# EasyEDA Pro project 21届智能车+蚂蚁搬家+主驱一体PCB文件.epro, board PCB2
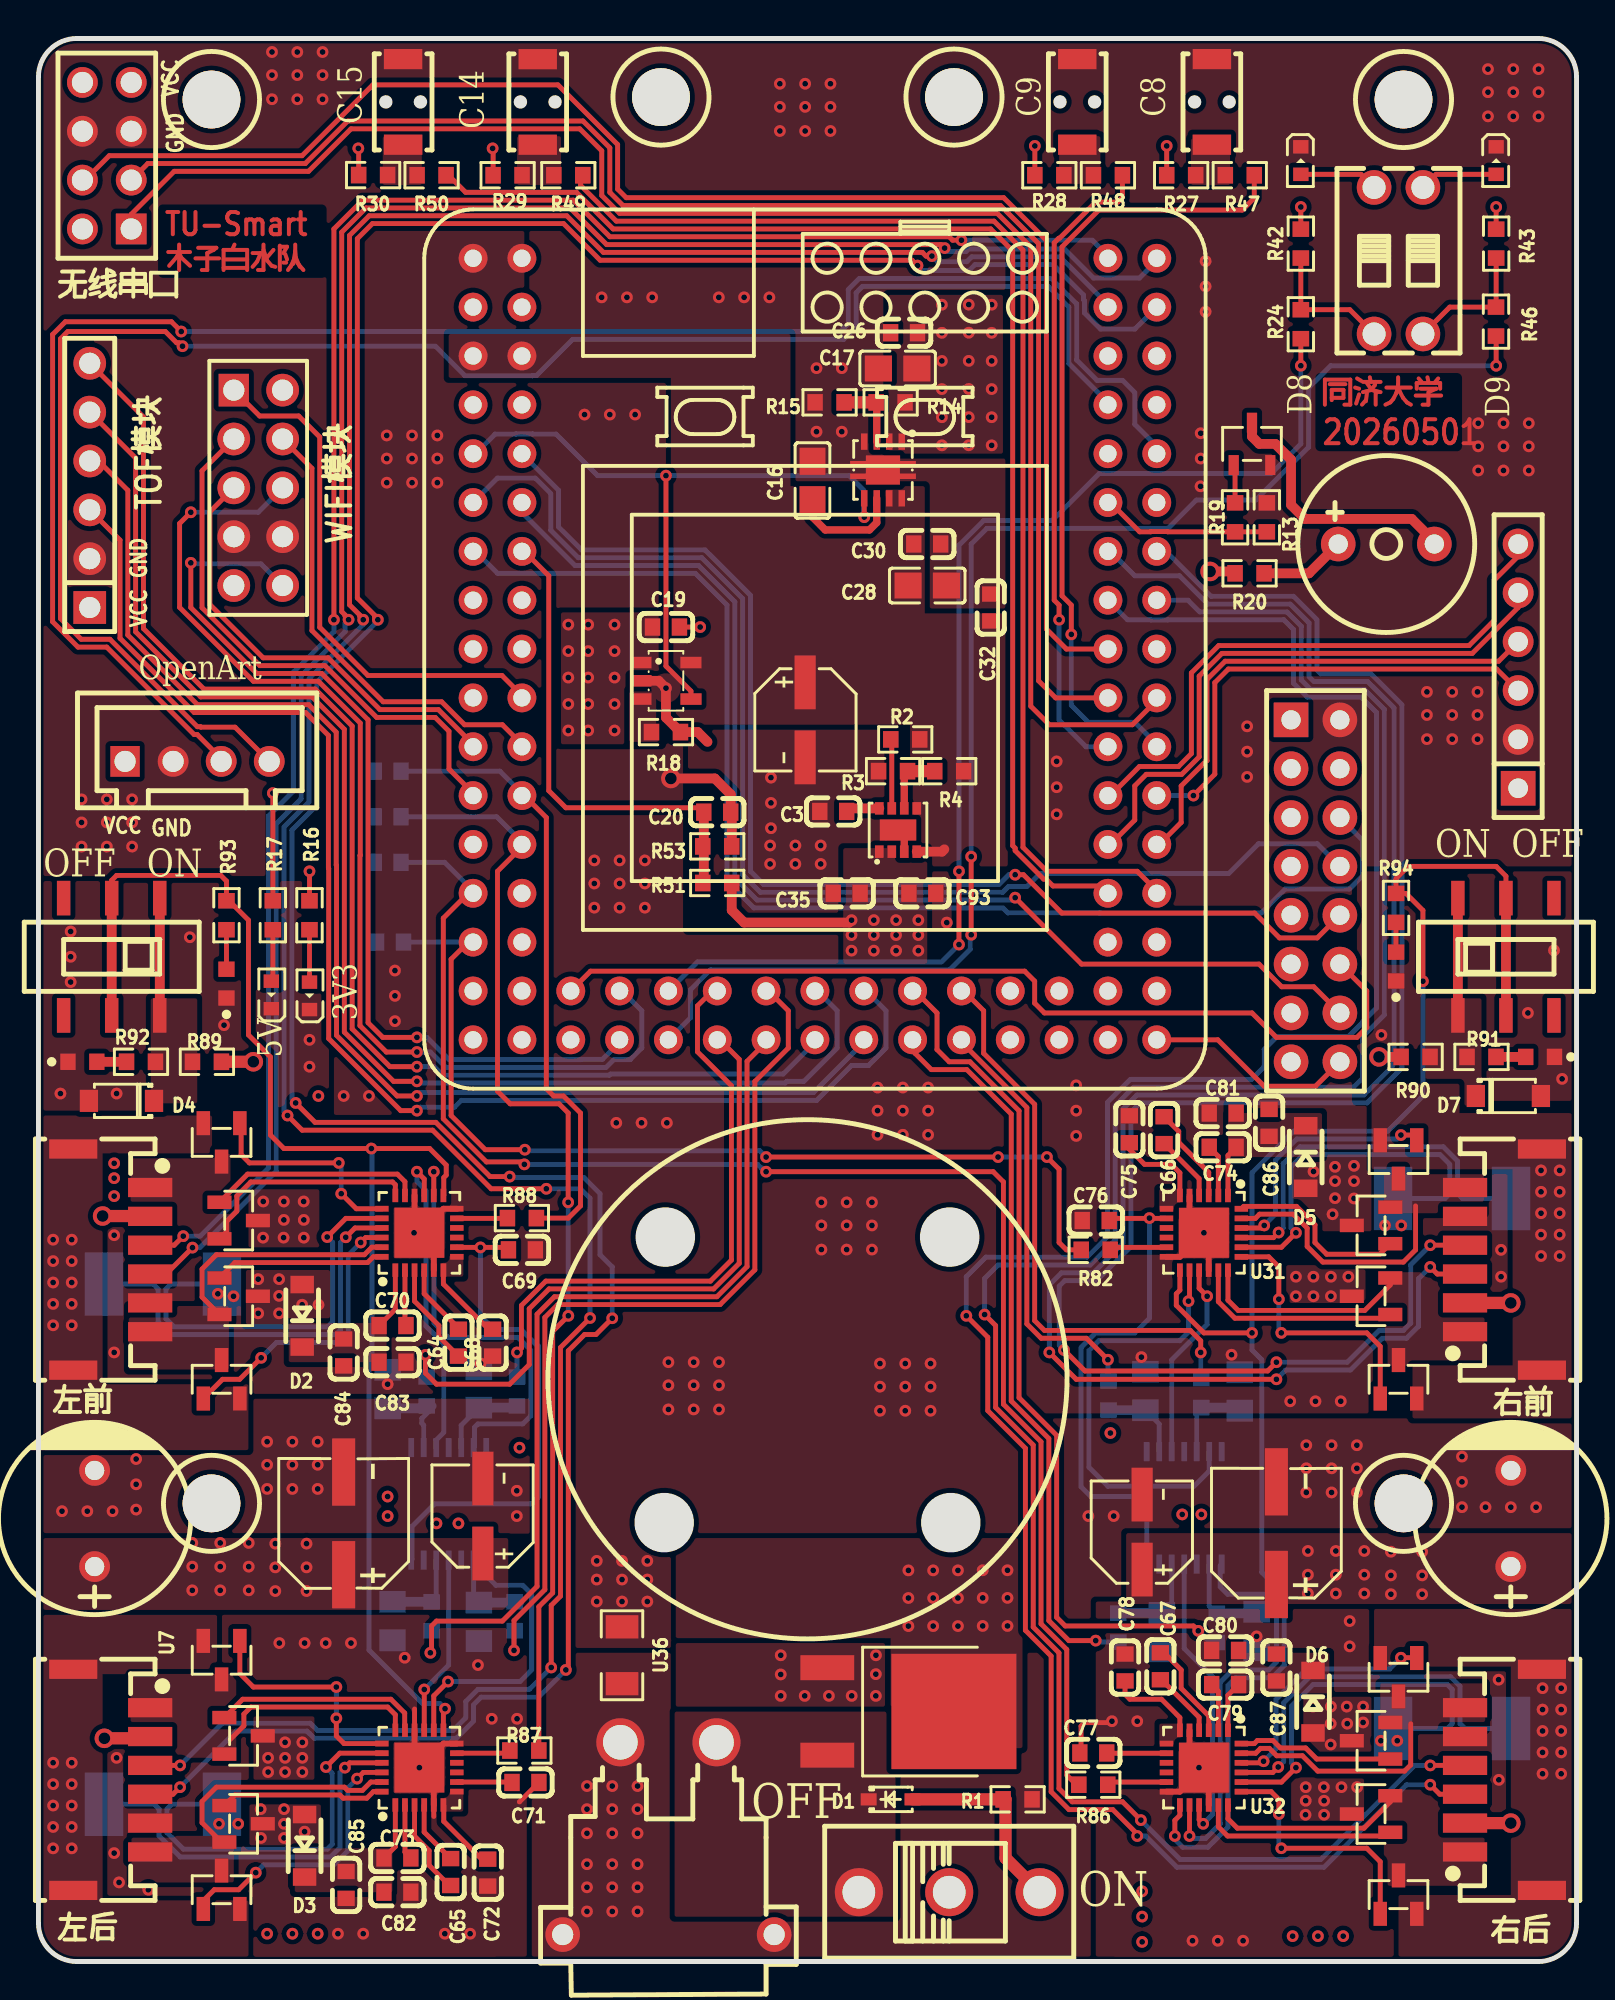
[diagram p37: board, top side]
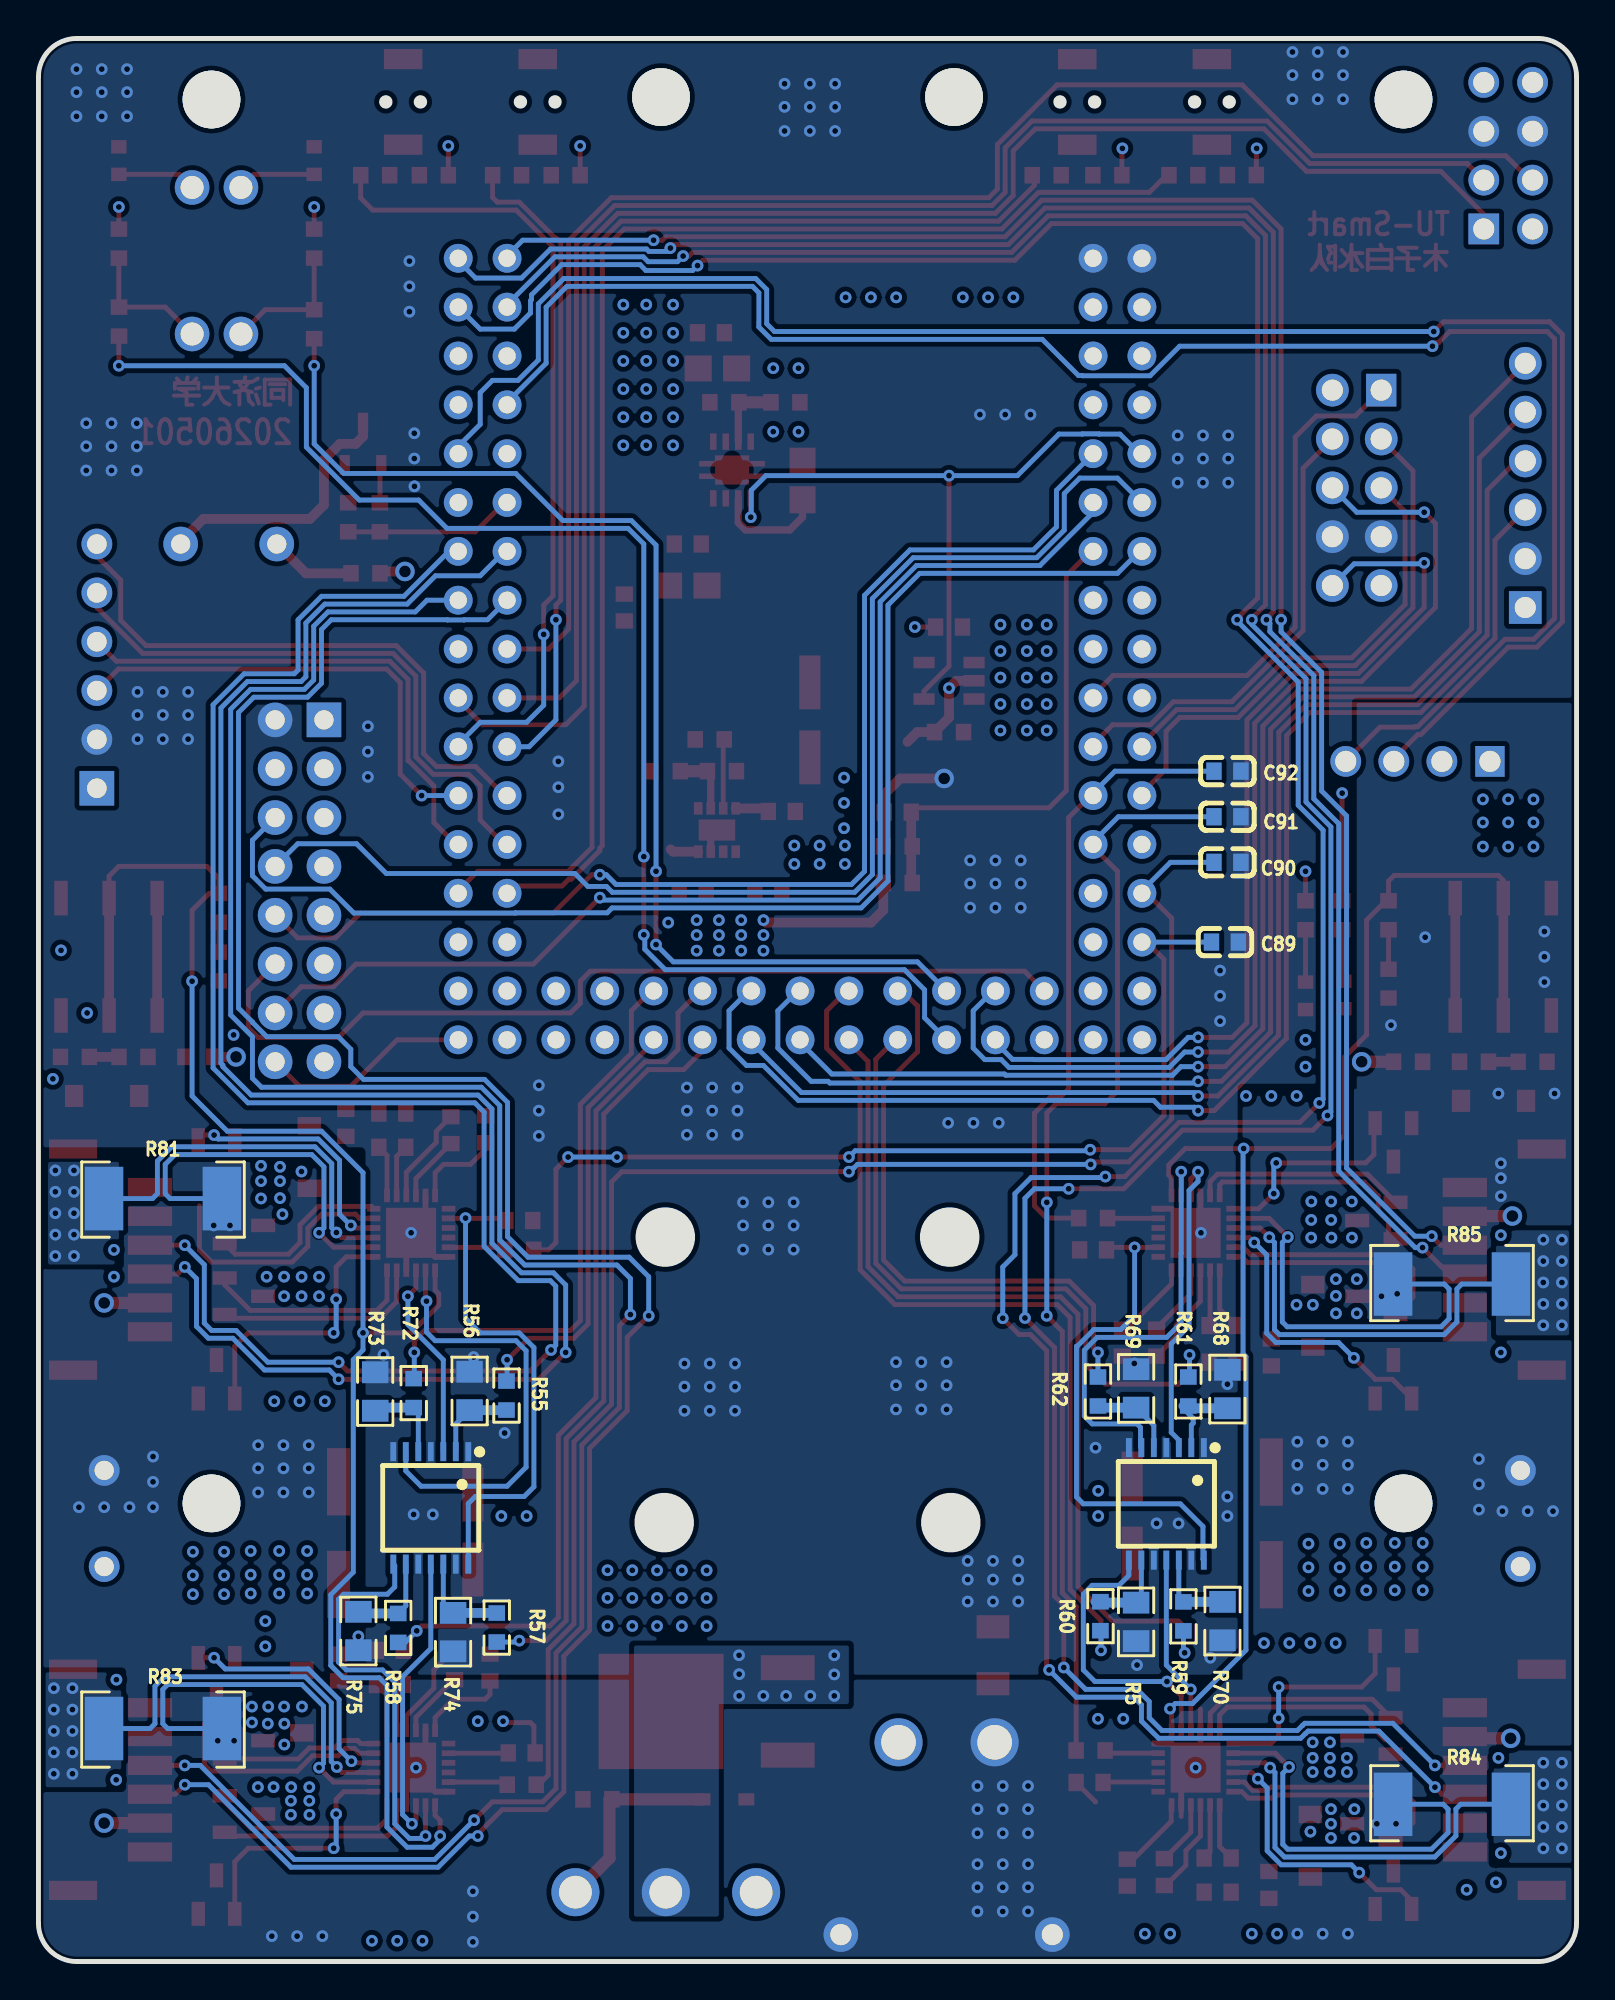
[diagram p38: board, bottom side, seen from below]

Outline 80 x 100 mm; copper layers: Top Layer, PGND, POWER, SIGNAL, GND, Bottom Layer. Coordinates in mm from the lower left corner of the outline.
Outline path: 0,98 0,2 arc(0.59,0.59) 2,0 78,0 arc(79.41,0.59) 80,2 80,98 arc(79.41,99.41) 78,100 2,100 arc(0.59,99.41) 0,98
Stack: Top Layer 0.035mm 外层铜厚1oz / Dielectric1 0.0994mm 3313 RC57% 4.2mil / PGND 0.0152mm 内层铜厚 / Dielectric2 0.55mm 0.55mm H/H No copper / POWER 0.0152mm 内层铜厚 / Dielectric3 0.1088mm 2116 RC54% 4.9mil / SIGNAL 0.0152mm 内层铜厚 / Dielectric4 0.55mm 0.55mm H/H No copper / GND 0.0152mm 内层铜厚 / Dielectric5 0.0994mm 3313 RC57% 4.2mil / Bottom Layer 0.035mm 外层铜厚1oz

## Design rules (mm)
spacing copperThickness1oz (default): track to track 0.152, other pairs 0.152 to 0.3
spacing copperThickness2oz: track to track 0.203, other pairs 0.152 to 0.3
spacing Plane_innerPlane: track to track 0.152, other pairs 0.152 to 0.3
spacing Copper_copperRegion: track to track 0.152, other pairs 0.152 to 0.3
spacing Copper_copperRegion1: track to track 0.152, other pairs 0.152 to 0.3
spacing Copper_copperRegion2: track to track 0.152, other pairs 0.152 to 0.3
track width copperThickness1oz (default): min 0.127, default 0.254, max 2.54
track width copperThickness2oz: min 0.203, default 0.254, max 2.54
differential pair differentialPair (default): width min 0.127, default 0.254, max 2.54; gap min 0.152, default 0.152
net PGND uses copperRegion1
pour e2148 uses Copper_copperRegion2, copperRegion2_Copper_copperRegion2
pour e2150 uses Copper_copperRegion2, copperRegion2_Copper_copperRegion2
pour e2152 uses Copper_copperRegion2, copperRegion2_Copper_copperRegion2
pour e2154 uses Copper_copperRegion2, copperRegion2_Copper_copperRegion2
pour e2156 uses Copper_copperRegion2, copperRegion2_Copper_copperRegion2
pour e2158 uses Copper_copperRegion2, copperRegion2_Copper_copperRegion2
pour e2160 uses Copper_copperRegion2, copperRegion2_Copper_copperRegion2
pour e2162 uses Copper_copperRegion2, copperRegion2_Copper_copperRegion2
pour e2164 uses Copper_copperRegion2, copperRegion2_Copper_copperRegion2
pour e2166 uses Copper_copperRegion2, copperRegion2_Copper_copperRegion2
pour e2168 uses Copper_copperRegion2, copperRegion2_Copper_copperRegion2
pour e2170 uses Copper_copperRegion2, copperRegion2_Copper_copperRegion2
pour e2172 uses Copper_copperRegion2, copperRegion2_Copper_copperRegion2
pour e2174 uses Copper_copperRegion2, copperRegion2_Copper_copperRegion2
pour e2176 uses Copper_copperRegion2, copperRegion2_Copper_copperRegion2
pour e2178 uses Copper_copperRegion2, copperRegion2_Copper_copperRegion2
pour e2180 uses Copper_copperRegion2, copperRegion2_Copper_copperRegion2
pour e2182 uses Copper_copperRegion2, copperRegion2_Copper_copperRegion2
pour e2184 uses Copper_copperRegion2, copperRegion2_Copper_copperRegion2
pour e2186 uses Copper_copperRegion2, copperRegion2_Copper_copperRegion2
pour e2188 uses Copper_copperRegion2, copperRegion2_Copper_copperRegion2
pour e2190 uses Copper_copperRegion2, copperRegion2_Copper_copperRegion2
pour e2192 uses Copper_copperRegion2, copperRegion2_Copper_copperRegion2
pour e2194 uses Copper_copperRegion2, copperRegion2_Copper_copperRegion2
pour e2196 uses Copper_copperRegion2, copperRegion2_Copper_copperRegion2
pour e2198 uses Copper_copperRegion2, copperRegion2_Copper_copperRegion2
pour e2200 uses Copper_copperRegion2, copperRegion2_Copper_copperRegion2
pour e2202 uses Copper_copperRegion2, copperRegion2_Copper_copperRegion2
pour e2204 uses Copper_copperRegion2, copperRegion2_Copper_copperRegion2
pour e2206 uses Copper_copperRegion2, copperRegion2_Copper_copperRegion2
pour e2208 uses Copper_copperRegion2, copperRegion2_Copper_copperRegion2
pour e2210 uses Copper_copperRegion2, copperRegion2_Copper_copperRegion2
pour e2212 uses Copper_copperRegion2, copperRegion2_Copper_copperRegion2
pour e2214 uses Copper_copperRegion2, copperRegion2_Copper_copperRegion2
pour e2216 uses Copper_copperRegion2, copperRegion2_Copper_copperRegion2
pour e2218 uses Copper_copperRegion2, copperRegion2_Copper_copperRegion2
pour e2220 uses Copper_copperRegion2, copperRegion2_Copper_copperRegion2
pour e2222 uses Copper_copperRegion2, copperRegion2_Copper_copperRegion2
pour e2224 uses Copper_copperRegion2, copperRegion2_Copper_copperRegion2
pour e2226 uses Copper_copperRegion2, copperRegion2_Copper_copperRegion2
pour e2228 uses Copper_copperRegion1, copperRegion2_Copper_copperRegion1
pour e2232 uses Copper_copperRegion1, copperRegion2_Copper_copperRegion1
pour e2236 uses Copper_copperRegion2, copperRegion2_Copper_copperRegion2
pour e2267 uses Copper_copperRegion2, copperRegion2_Copper_copperRegion2
pour e2269 uses Copper_copperRegion2, copperRegion2_Copper_copperRegion2
pour e2271 uses Copper_copperRegion2, copperRegion2_Copper_copperRegion2
pour e2273 uses Copper_copperRegion2, copperRegion2_Copper_copperRegion2
pour e2275 uses Copper_copperRegion2, copperRegion2_Copper_copperRegion2
pour e2277 uses Copper_copperRegion2, copperRegion2_Copper_copperRegion2
pour e2279 uses Copper_copperRegion2, copperRegion2_Copper_copperRegion2
pour e2281 uses Copper_copperRegion2, copperRegion2_Copper_copperRegion2
pour e2283 uses Copper_copperRegion2, copperRegion2_Copper_copperRegion2
pour e2285 uses Copper_copperRegion2, copperRegion2_Copper_copperRegion2
pour e2287 uses Copper_copperRegion2, copperRegion2_Copper_copperRegion2
pour e2289 uses Copper_copperRegion2, copperRegion2_Copper_copperRegion2
pour e2291 uses Copper_copperRegion2, copperRegion2_Copper_copperRegion2
pour e2293 uses Copper_copperRegion1, copperRegion2_Copper_copperRegion1
pour e2295 uses Copper_copperRegion2, copperRegion2_Copper_copperRegion2
pour e2297 uses Copper_copperRegion2, copperRegion2_Copper_copperRegion2
pour e2302 uses Copper_copperRegion2, copperRegion2_Copper_copperRegion2
pour e2306 uses Copper_copperRegion1, copperRegion2_Copper_copperRegion1
pour e2308 uses Copper_copperRegion2, copperRegion2_Copper_copperRegion2
pour e2311 uses Copper_copperRegion1, copperRegion2_Copper_copperRegion1
pour e2315 uses Copper_copperRegion1, copperRegion2_Copper_copperRegion1
pour e2317 uses Copper_copperRegion1, copperRegion2_Copper_copperRegion1
pour e2319 uses Copper_copperRegion1, copperRegion2_Copper_copperRegion1
pour e2324 uses Copper_copperRegion2, copperRegion2_Copper_copperRegion2

## Placement (name value [footprint] x y rotation side)
BUZZER1  3kHz  [BUZ-TH_BD9.0-P5.00-D0.6-FD]  70.1 73.71 0 top
C3  430pF  [C0603]  41.34 59.81 180 top
C16  10nF  [C0805]  40.26 77.01 270 top
C17  4.7uF  [C0805]  44.69 82.84 0 top
C19  100nF  [C0603]  32.64 69.39 180 top
C20  100nF  [C0603]  35.31 59.77 180 top
C21  47uF  [CAP-SMD_BD5.0-L5.3-W5.3-LS5.9-FD]  39.88 64.57 270 top
C25  1000uF  [CAP-TH_BD10.0-P5.00-D0.6-FD]  76.58 23.04 90 top
C26  100nF  [C0603]  45.02 84.7 180 top
C28  10uF  [C0805]  46.23 71.55 0 top
C30  100nF  [C0603]  46.23 73.71 0 top
C32  100nF  [C0603]  49.53 70.41 90 top
C35  100nF  [C0603]  42.04 55.55 0 top
C56  220uF  [CAP-SMD_BD6.3-L6.6-W6.6-LS7.3-FD-H7.7]  15.88 22.78 90 top
C57  220uF  [CAP-SMD_BD6.3-L6.6-W6.6-LS7.3-FD-H7.7]  64.39 22.28 90 top
C58  47uF  [CAP-SMD_BD5.0-L5.3-W5.3-LS5.9-FD]  23.11 23.16 90 top
C59  47uF  [CAP-SMD_BD5.0-L5.3-W5.3-LS5.9-FD]  57.4 22.33 90 top
C64  100nF  [C0603]  21.84 32.18 90 top
C65  100nF  [C0603]  21.44 4.65 90 top
C66  100nF  [C0603]  58.55 43.23 270 top
C67  100nF  [C0603]  58.35 15.35 270 top
C68  1uF  [C0603]  23.62 32.18 90 top
C69  1uF  [C0603]  25.15 37.01 180 top
C70  1uF  [C0603]  18.41 33.07 180 top
C71  1uF  [C0603]  25.33 9.31 180 top
C72  1uF  [C0603]  23.37 4.62 90 top
C73  1uF  [C0603]  18.67 5.38 180 top
C74  1uF  [C0603]  61.59 42.34 0 top
C75  1uF  [C0603]  56.74 43.28 270 top
C76  1uF  [C0603]  54.99 38.53 0 top
C77  1uF  [C0603]  54.86 10.85 0 top
C78  1uF  [C0603]  56.51 15.29 270 top
C79  1uF  [C0603]  61.72 14.4 0 top
C80  100nF  [C0603]  61.72 16.18 0 top
C81  100nF  [C0603]  61.59 44.12 0 top
C82  100nF  [C0603]  18.67 3.61 180 top
C83  100nF  [C0603]  18.41 31.17 180 top
C84  10uF  [C0603]  15.88 31.67 270 top
C85  10uF  [C0603]  16 3.99 270 top
C86  10uF  [C0603]  64.01 43.61 90 top
C87  10uF  [C0603]  64.39 15.29 90 top
C88  1000uF  [CAP-TH_BD10.0-P5.00-D0.6-FD]  2.92 23.04 90 top
C89  1nF  [C0603]  18.29 53.01 180 bottom
C90  1nF  [C0603]  18.16 57.16 180 bottom
C91  1nF  [C0603]  18.16 59.53 180 bottom
C92  1nF  [C0603]  18.16 61.9 180 bottom
C93  10uF  [C0603]  45.97 55.55 180 top
CN1  HC-PM254-8.5H-2x5PZ  [HDR-TH_10P-P2.54-V-F-R2-C5-S2.54-1]  11.43 76.63 270 top
CN2  ZX-XH2.54-4PZZ  [CONN-TH_4P-P2.50_4PIN]  8.25 62.41 0 top
CN3  XT30PW-M30.G.Y  [CONN-TH_XT30PW-M]  32.77 6.4 0 top
D1  BZT52C16S  [SOD-323_L1.7-W1.3-LS2.6-RD]  44.32 8.43 0 top
D2  1N5819W  [SOD-123_L2.7-W1.6-LS3.7-R-RD]  13.72 33.58 90 top
D3  1N5819W  [SOD-123_L2.7-W1.6-LS3.7-R-RD]  13.84 6.02 90 top
D4  BZT52C3V3  [SOD-123_L2.8-W1.8-LS3.7-RD]  4.32 44.75 180 top
D5  1N5819W  [SOD-123_L2.7-W1.6-LS3.7-R-RD]  65.91 41.83 270 top
D6  1N5819W  [SOD-123_L2.7-W1.6-LS3.7-R-RD]  66.29 13.51 270 top
D7  BZT52C3V3  [SOD-123_L2.8-W1.8-LS3.7-RD]  76.45 45.01 0 top
FH1  智能车逐飞摄像头固定孔  [智能车逐飞摄像头支架固定孔]  40 30.28 0 top
H1  PZ254V-11-06P  [HDR-TH_6P-P2.54-V-M]  2.67 76.76 90 top
J1  2.54-2*8P母  [HDR-TH_16P-P2.54-V-F-R2-C8-S2.54]  66.42 55.68 270 top
LED1  Blue  [LEDC1608(0603)]  9.78 50.85 90 top
LED2  =Color  [LEDC1608(0603)]  2.29 46.79 0 top
LED3  Blue  [LEDC1608(0603)]  70.61 51.74 90 top
LED4  =Color  [LEDC1608(0603)]  78.1 47.04 180 top
NOREF  -  [Pad_e629]  71 96.83 0 top
NOREF#2  -  [Pad_e628]  71 23.82 0 top
NOREF#3  -  [Pad_e627]  9 23.82 0 top
NOREF#4  -  [Pad_e626]  9 96.83 0 top
NOREF#5  -  [Pad_e630]  32.38 96.95 0 top
NOREF#6  -  [Pad_e631]  47.62 96.95 0 top
P4  2.54-1*6P母  [HDR-TH_6P-P2.54-V-F]  76.96 67.36 90 top
Q1  HY19P03D  [TO-252-2_L6.6-W6.1-P4.57-LS9.9-TL-CW]  44.32 13 0 top
Q10  S8050 J3Y(RANGE:200-350)  [SOT-23-3_L3.0-W1.7-P0.95-LS2.9-BR]  63.12 78.92 270 top
Q22  AO3400A  [SOT-23-3_L2.9-W1.3-P1.90-LS2.4-BR]  69.31 38.28 0 top
Q23  AO3400A  [SOT-23-3_L2.9-W1.3-P1.90-LS2.4-BR]  70.74 41.71 90 top
Q24  AO3400A  [SOT-23-3_L2.9-W1.3-P1.90-LS2.4-BR]  69.31 34.59 0 top
Q25  AO3400A  [SOT-23-3_L2.9-W1.3-P1.90-LS2.4-BR]  70.74 30.28 270 top
Q26  AO3400A  [SOT-23-3_L2.9-W1.3-P1.90-LS2.4-BR]  70.74 3.48 270 top
Q27  AO3400A  [SOT-23-3_L2.9-W1.3-P1.90-LS2.4-BR]  69.31 7.67 0 top
Q28  AO3400A  [SOT-23-3_L2.9-W1.3-P1.90-LS2.4-BR]  69.31 11.48 0 top
Q29  AO3400A  [SOT-23-3_L2.9-W1.3-P1.90-LS2.4-BR]  70.74 14.78 90 top
Q30  AO3400A  [SOT-23-3_L2.9-W1.3-P1.90-LS2.4-BR]  10.67 7.16 180 top
Q31  AO3400A  [SOT-23-3_L2.9-W1.3-P1.90-LS2.4-BR]  9.53 3.73 270 top
Q32  AO3400A  [SOT-23-3_L2.9-W1.3-P1.90-LS2.4-BR]  9.53 30.28 270 top
Q33  AO3400A  [SOT-23-3_L2.9-W1.3-P1.90-LS2.4-BR]  10.41 34.59 180 top
Q34  AO3400A  [SOT-23-3_L2.9-W1.3-P1.90-LS2.4-BR]  10.67 11.74 180 top
Q35  AO3400A  [SOT-23-3_L2.9-W1.3-P1.90-LS2.4-BR]  9.53 15.67 90 top
Q36  AO3400A  [SOT-23-3_L2.9-W1.3-P1.90-LS2.4-BR]  10.41 38.53 180 top
Q37  AO3400A  [SOT-23-3_L2.9-W1.3-P1.90-LS2.4-BR]  9.53 42.6 90 top
R1  10kΩ  [R0603]  50.93 8.43 180 top
R2  100kΩ  [R0603]  45.09 63.55 180 top
R3  100kΩ  [R0603]  44.45 61.9 180 top
R4  523kΩ  [R0603]  47.37 61.9 180 top
R5  10kΩ  [R0805]  22.91 17.66 90 bottom
R13  4.7kΩ  [R0603]  62.24 75.1 270 top
R14  30.9kΩ  [R0603]  44.32 81.08 0 top
R15  10kΩ  [R0603]  41.15 81.08 0 top
R16  2.7kΩ  [R0603]  14.1 54.41 90 top
R17  10kΩ  [R0603]  12.19 54.41 90 top
R18  4.7kΩ  [R0603]  32.64 63.93 180 top
R19  1kΩ  [R0603]  63.89 75.1 90 top
R20  10Ω  [R0603]  62.99 72.19 0 top
R24  100Ω  [R0603]  65.66 85.14 270 top
R27  4.7kΩ  [R0603]  59.44 92.89 180 top
R28  4.7kΩ  [R0603]  52.58 92.89 180 top
R29  4.7kΩ  [R0603]  24.4 92.89 180 top
R30  4.7kΩ  [R0603]  17.41 92.9 180 top
R42  4.7kΩ  [R0603]  65.66 89.33 90 top
R43  4.7kΩ  [R0603]  75.82 89.33 90 top
R46  100Ω  [R0603]  75.81 85.28 270 top
R47  100Ω  [R0603]  62.48 92.89 0 top
R48  100Ω  [R0603]  55.63 92.89 0 top
R49  100Ω  [R0603]  27.56 92.89 0 top
R50  100Ω  [R0603]  20.45 92.89 0 top
R51  10kΩ  [R0603]  35.31 56.08 180 top
R53  1kΩ  [R0603]  35.31 57.99 0 top
R55  100Ω  [R0603]  55.66 29.43 270 bottom
R56  100Ω  [R0603]  60.48 29.56 90 bottom
R57  100Ω  [R0603]  56.16 17.37 90 bottom
R58  100Ω  [R0603]  61.29 17.35 270 bottom
R59  100Ω  [R0603]  20.45 17.95 90 bottom
R60  100Ω  [R0603]  24.76 17.96 270 bottom
R61  100Ω  [R0603]  20.19 29.64 270 bottom
R62  100Ω  [R0603]  24.89 29.64 90 bottom
R68  10kΩ  [R0805]  18.16 29.77 90 bottom
R69  10kΩ  [R0805]  22.91 29.8 90 bottom
R70  10kΩ  [R0805]  18.41 17.7 90 bottom
R72  10kΩ  [R0805]  57.58 29.67 90 bottom
R73  10kΩ  [R0805]  62.48 29.64 90 bottom
R74  10kΩ  [R0805]  58.43 17.13 90 bottom
R75  10kΩ  [R0805]  63.36 17.19 90 bottom
R81  100mΩ  [RES-SMD_L6.4-W3.2-R2512]  73.52 39.67 0 bottom
R82  100Ω  [R0603]  54.99 37.01 0 top
R83  100mΩ  [RES-SMD_L6.4-W3.2-R2512]  73.52 12.12 0 bottom
R84  100mΩ  [RES-SMD_L6.4-W3.2-R2512]  6.48 8.18 180 bottom
R85  100mΩ  [RES-SMD_L6.4-W3.2-R2512]  6.48 35.23 180 bottom
R86  100Ω  [R0603]  54.86 9.19 0 top
R87  100Ω  [R0603]  25.27 10.97 180 top
R88  100Ω  [R0603]  25.15 38.66 180 top
R89  2.2kΩ  [R0603]  8.76 46.79 180 top
R90  2.2kΩ  [R0603]  71.63 47.04 0 top
R91  1kΩ  [R0603]  75.06 47.04 180 top
R92  1kΩ  [R0603]  5.33 46.79 0 top
R93  330Ω  [R0603]  9.78 54.41 270 top
R94  330Ω  [R0603]  70.61 54.79 270 top
SW2  SS-12D10L5R  [SW-TH_SS-12D10L9]  47.37 3.61 0 top
SW3  DSWB02LHGET  [SW-TH_DSWB02LHGET]  70.74 88.44 180 top
U2  DRV8701E  [VQFN-24_L4.0-W4.0-P0.50-BL-EP2.5]  19.81 10.08 0 top
U3  SN74HC125PWR  [TSSOP-14_L5.0-W4.4-P0.65-LS6.5-BL]  21.34 23.8 0 bottom
U5  SS-3235S-L1  [SW-SMD_SS-3235S-LX]  3.81 52.25 0 top
U7  ZX-ZH1.5-6PWT  [CONN-SMD_6P-P1.50_ZX-ZH1.5-6PWT]  3.81 9.45 270 top
U8  ZX-QC34-2TPDZ  [KEY-SMD_L3.9-W3.0-LS5.0-EH]  61.03 96.7 90 top
U9  ZX-QC34-2TPDZ  [KEY-SMD_L3.9-W3.0-LS5.0-EH]  54.03 96.7 90 top
U10  ZX-QC34-2TPDZ  [KEY-SMD_L3.9-W3.0-LS5.0-EH]  25.97 96.7 90 top
U11  ZX-QC34-2TPDZ  [KEY-SMD_L3.9-W3.0-LS5.0-EH]  18.97 96.7 90 top
U12  TPS82130SILR  [USIP-8_L3.0-W2.8-P0.65-TL-EP]  44.71 58.84 90 top
U13  ZX-ZH1.5-6PWT  [CONN-SMD_6P-P1.50_ZX-ZH1.5-6PWT]  3.81 36.5 270 top
U14  ZX-ZH1.5-6PWT  [CONN-SMD_6P-P1.50_ZX-ZH1.5-6PWT]  76.2 9.45 90 top
U15  ZX-ZH1.5-6PWT  [CONN-SMD_6P-P1.50_ZX-ZH1.5-6PWT]  76.2 36.5 90 top
U19  TPS7A8001DRBR  [VSON-8_L3.0-W3.0-P0.65-TL-EP]  43.93 77.56 270 top
U20  42-51/GHC-YW2X2K/3T  [LED-SMD_L1.6-W0.8-FD_GREEN-1]  14.1 50.22 270 top
U21  SY6280AAC  [SOT-23-5_L3.0-W1.7-P0.95-LS2.8-BR]  32.64 66.6 180 top
U22  42-51/GHC-YW2X2K/3T  [LED-SMD_L1.6-W0.8-FD_GREEN-1]  12.11 50.26 270 top
U23  42-51/GHC-YW2X2K/3T  [LED-SMD_L1.6-W0.8-FD_GREEN-1]  75.82 93.65 90 top
U24  42-51/GHC-YW2X2K/3T  [LED-SMD_L1.6-W0.8-FD_GREEN-1]  65.66 93.65 90 top
U25  HC-PM254-8.5H-2x4PZ-02A  [HDR-TH_8P-P2.54-V-F-R2-C4-S2.54]  3.56 93.9 90 top
U26  MIMXRT1021xAGxA_CoreBoard  [MIMXRT1021xAGxA_CoreBoard_V2.x]  40.39 68.25 0 top
U30  DRV8701E  [VQFN-24_L4.0-W4.0-P0.50-BL-EP2.5]  19.81 37.9 0 top
U31  DRV8701E  [VQFN-24_L4.0-W4.0-P0.50-BL-EP2.5]  60.62 37.89 180 top
U32  DRV8701E  [VQFN-24_L4.0-W4.0-P0.50-BL-EP2.5]  60.62 10.08 180 top
U33  SN74HC125PWR  [TSSOP-14_L5.0-W4.4-P0.65-LS6.5-BL]  59.59 23.59 0 bottom
U34  SS-3235S-L1  [SW-SMD_SS-3235S-LX]  76.33 52.25 180 top
U36  0Ω  [R1206]  30.35 15.93 270 top

## Footprints (pads in the part's own frame, mm; a bottom-side part is the same pattern mirrored in y, then rotated)
BUZ-TH_BD9.0-P5.00-D0.6-FD
  round 1.8 hole 1: 1(-2.5,0) 2(2.5,0)
C0603
  rect 0.8x0.9 smd: 1(-0.7,0) 2(0.7,0)
C0805
  rect 1.41x1.35 smd: 1(-1,0) 2(1,0)
CAP-SMD_BD5.0-L5.3-W5.3-LS5.9-FD
  rect 2.8x1.1 smd: 1(-1.95,0) 2(1.95,0)
CAP-SMD_BD6.3-L6.6-W6.6-LS7.3-FD-H7.7
  rect 3.5x1.2 smd: 1(-2.67,0) 2(2.67,0)
CAP-TH_BD10.0-P5.00-D0.6-FD
  round 1.6 hole 1: 1(-2.5,0) 2(2.5,0)
CONN-SMD_6P-P1.50_ZX-ZH1.5-6PWT
  rect 1x2.3 smd: 1(-3.75,2) 2(-2.25,2) 3(-0.75,2) 4(0.75,2) 5(2.25,2) 6(3.75,2)
  rect 1x2.5 smd: 7(5.75,-2) 8(-5.75,-2)
CONN-TH_4P-P2.50_4PIN
  rect 1.524x1.6 hole 1.1: 1(-3.75,0)
  round 1.6 hole 1.1: 2(-1.25,0) 3(1.25,0) 4(3.75,0)
CONN-TH_XT30PW-M
  round 2.5 hole 1.8: 1(-2.5,5) 2(2.5,5)
  round 1.8 hole 1.1: 3(5.5,-5) 4(-5.5,-5)
HDR-TH_6P-P2.54-V-F
  rect 1.8x1.8 hole 1.02: 1(-6.35,0)
  round 1.6 hole 1.02: 2(-3.81,0) 3(-1.27,0) 4(1.27,0) 5(3.81,0) 6(6.35,0)
HDR-TH_6P-P2.54-V-M
  rect 1.7x1.7 hole 1.1: 1(-6.35,0)
  round 1.7 hole 1.1: 2(-3.81,0) 3(-1.27,0) 4(1.27,0) 5(3.81,0) 6(6.35,0)
HDR-TH_8P-P2.54-V-F-R2-C4-S2.54
  rect 1.6x1.6 hole 1.1: 1(-3.81,-1.27)
  round 1.6 hole 1.1: 2(-3.81,1.27) 3(-1.27,-1.27) 4(-1.27,1.27) 5(1.27,-1.27) 6(1.27,1.27) 7(3.81,-1.27) 8(3.81,1.27)
HDR-TH_10P-P2.54-V-F-R2-C5-S2.54-1
  rect 1.7x1.575 hole 1.1: 1(-5.08,-1.27)
  round 1.7 hole 1.1: 2(-5.08,1.27) 3(-2.54,-1.27) 4(-2.54,1.27) 5(0,-1.27) 6(0,1.27) 7(2.54,-1.27) 8(2.54,1.27) 9(5.08,-1.27) 10(5.08,1.27)
HDR-TH_16P-P2.54-V-F-R2-C8-S2.54
  rect 1.8x1.8 hole 1: 1(-8.89,-1.27)
  round 1.8 hole 1: 2(-8.89,1.27) 3(-6.35,-1.27) 4(-6.35,1.27) 5(-3.81,-1.27) 6(-3.81,1.27) 7(-1.27,-1.27) 8(-1.27,1.27) 9(1.27,-1.27) 10(1.27,1.27) 11(3.81,-1.27) 12(3.81,1.27) 13(6.35,-1.27) 14(6.35,1.27) 15(8.89,-1.27) 16(8.89,1.27)
KEY-SMD_L3.9-W3.0-LS5.0-EH
  rect 1.05x2 smd: 1(-2.225,0) 2(2.225,0)
LED-SMD_L1.6-W0.8-FD_GREEN-1
  rect 0.7x0.8 smd: 1(-0.715,0) 2(0.715,0)
LEDC1608(0603)
  rect 0.8x0.85 smd: A(0.75,0) C(-0.75,0)
MIMXRT1021xAGxA_CoreBoard_V2.x
  round 1.5 hole 0.9: 1(-17.78,20.32) 2(-15.24,20.32) 3(-17.78,17.78) 4(-15.24,17.78) 5(-17.78,15.24) 6(-15.24,15.24) 7(-17.78,12.7) 8(-15.24,12.7) 9(-17.78,10.16) 10(-15.24,10.16) 11(-17.78,7.62) 12(-15.24,7.62) 13(-17.78,5.08) 14(-15.24,5.08) 15(-17.78,2.54) 16(-15.24,2.54) 17(-17.78,0) 18(-15.24,0) 19(-17.78,-2.54) 20(-15.24,-2.54) 21(-17.78,-5.08) 22(-15.24,-5.08) 23(-17.78,-7.62) 24(-15.24,-7.62) 25(-17.78,-10.16) 26(-15.24,-10.16) 27(-17.78,-12.7) 28(-15.24,-12.7) 29(-17.78,-15.24) 30(-15.24,-15.24) 31(-17.78,-20.32) 32(-17.78,-17.78) 33(-15.24,-20.32) 34(-15.24,-17.78) 35(-12.7,-20.32) 36(-12.7,-17.78) 37(-10.16,-20.32) 38(-10.16,-17.78) 39(-7.62,-20.32) 40(-7.62,-17.78) 41(-5.08,-20.32) 42(-5.08,-17.78) 43(-2.54,-20.32) 44(-2.54,-17.78) 45(0,-20.32) 46(0,-17.78) 47(2.54,-20.32) 48(2.54,-17.78) 49(5.08,-20.32) 50(5.08,-17.78) 51(7.62,-20.32) 52(7.62,-17.78) 53(10.16,-20.32) 54(10.16,-17.78) 55(12.7,-20.32) 56(12.7,-17.78) 57(15.24,-20.32) 58(15.24,-17.78) 59(17.78,-20.32) 60(17.78,-17.78) 61(15.24,-15.24) 62(17.78,-15.24) 63(15.24,-12.7) 64(17.78,-12.7) 65(15.24,-10.16) 66(17.78,-10.16) 67(15.24,-7.62) 68(17.78,-7.62) 69(15.24,-5.08) 70(17.78,-5.08) 71(15.24,-2.54) 72(17.78,-2.54) 73(15.24,0) 74(17.78,0) 75(15.24,2.54) 76(17.78,2.54) 77(15.24,5.08) 78(17.78,5.08) 79(15.24,7.62) 80(17.78,7.62) 81(15.24,10.16) 82(17.78,10.16) 83(15.24,12.7) 84(17.78,12.7) 85(15.24,15.24) 86(17.78,15.24) 87(15.24,17.78) 88(17.78,17.78) 89(15.24,20.32) 90(17.78,20.32)
Pad_e626
  round 3 hole 3: 1(0,0)
Pad_e627
  round 3 hole 3: 1(0,0)
Pad_e628
  round 3 hole 3: 1(0,0)
Pad_e629
  round 3 hole 3: 1(0,0)
Pad_e630
  round 3 hole 3: 1(0,0)
Pad_e631
  round 3 hole 3: 1(0,0)
R0603
  rect 0.806x0.864 smd: 1(-0.753,0) 2(0.753,0)
R0805
  rect 1.133x1.377 smd: 1(-1,0) 2(1,0)
R1206
  rect 1.208x1.701 smd: 1(-1.479,0) 2(1.479,0)
RES-SMD_L6.4-W3.2-R2512
  rect 2x3.3 smd: 1(-3.067,0) 2(3.067,0)
SOD-123_L2.7-W1.6-LS3.7-R-RD
  rect 0.909x1.219 smd: 1(1.625,0) 2(-1.625,0)
SOD-123_L2.8-W1.8-LS3.7-RD
  rect 0.95x1.15 smd: 1(-1.692,0) 2(1.692,0)
SOD-323_L1.7-W1.3-LS2.6-RD
  rect 0.83x0.63 smd: 1(-1.14,0) 2(1.14,0)
SOT-23-3_L2.9-W1.3-P1.90-LS2.4-BR
  rect 1.25x0.7 smd: 1(1,-0.95) 2(1,0.95) 3(-1,0)
SOT-23-3_L3.0-W1.7-P0.95-LS2.9-BR
  rect 1.038x0.532 smd: 1(1.101,-0.95) 2(1.101,0.95) 3(-1.101,0)
SOT-23-5_L3.0-W1.7-P0.95-LS2.8-BR
  rect 1.1x0.6 smd: 1(1.3,-0.95) 2(1.3,0) 3(1.3,0.95) 4(-1.3,0.95) 5(-1.3,-0.95)
SW-SMD_SS-3235S-LX
  rect 0.7x1.8 smd: 1(-2.5,3.05) 2(0,3.05) 3(2.5,3.05) 4(-2.5,-3.05) 5(0,-3.05) 6(2.5,-3.05)
SW-TH_DSWB02LHGET
  round 1.8 hole 1.2: 1(-1.27,3.81) 2(1.27,3.81) 3(-1.27,-3.81) 4(1.27,-3.81)
SW-TH_SS-12D10L9
  round 2.5 hole 1.7: 1(-4.7,0) 2(0,0) 3(4.7,0)
TO-252-2_L6.6-W6.1-P4.57-LS9.9-TL-CW
  rect 2.8x1.3 smd: 1(-3.292,2.273) 3(-3.292,-2.273)
  rect 6.5x6 smd: 2(3.292,0)
TSSOP-14_L5.0-W4.4-P0.65-LS6.5-BL
  rect 0.305x0.991 smd: 1(-1.95,-2.925) 2(-1.3,-2.925) 3(-0.65,-2.925) 4(0,-2.925) 5(0.65,-2.925) 6(1.3,-2.925) 7(1.95,-2.925) 8(1.95,2.925) 9(1.3,2.925) 10(0.65,2.925) 11(0,2.925) 12(-0.65,2.925) 13(-1.3,2.925) 14(-1.95,2.925)
USIP-8_L3.0-W2.8-P0.65-TL-EP
  rect 0.65x0.45 smd: 1(-1.125,0.975) 2(-1.125,0.325) 3(-1.125,-0.325) 4(-1.125,-0.975) 5(1.125,-0.975) 6(1.125,-0.325) 7(1.125,0.325) 8(1.125,0.975)
  rect 1.1x1.9 smd: 9(0,0)
VQFN-24_L4.0-W4.0-P0.50-BL-EP2.5
  rect 0.3x0.7 smd: 1(-1.25,-1.942) 2(-0.75,-1.942) 3(-0.25,-1.942) 4(0.25,-1.942) 5(0.75,-1.942) 6(1.25,-1.942) 13(1.25,1.942) 14(0.75,1.942) 15(0.25,1.942) 16(-0.25,1.942) 17(-0.75,1.942) 18(-1.25,1.942)
  rect 0.7x0.3 smd: 7(1.948,-1.25) 8(1.948,-0.75) 9(1.948,-0.25) 10(1.948,0.25) 11(1.948,0.75) 12(1.948,1.25) 19(-1.948,1.25) 20(-1.948,0.75) 21(-1.948,0.25) 22(-1.948,-0.25) 23(-1.948,-0.75) 24(-1.948,-1.25)
  rect 2.6x2.6 smd: 25(0.001,-0.001)
VSON-8_L3.0-W3.0-P0.65-TL-EP
  rect 0.85x0.34 smd: 1(-1.476,0.975) 2(-1.476,0.325) 3(-1.476,-0.325) 4(-1.476,-0.976) 5(1.476,-0.976) 6(1.476,-0.325) 7(1.476,0.325) 8(1.476,0.976)
  custom 1.52x3.42 smd: 9(0,-0.005)

## Nets
As in the schematic, except:
GND: C20.1 C68.1 C69.1 C71.1 C72.1 C75.1 C76.1 C77.1 C78.1 C80.1 C81.1 C82.1 C83.1 C84.2 C85.2 C86.2 C87.2 C89.2 C90.2 C91.2 C92.2 CN1.7 CN1.8 CN2.2 H1.2 J1.2 P4.2 Q10.2 R5.1 R19.2 R53.2 R68.2 R69.2 R70.1 R72.2 R73.2 R74.1 R75.1 U2.5 U2.12 U2.16 U2.25 U3.1 U3.4 U3.7 U3.10 U3.13 U7.5 U8.2 U9.2 U10.2 U11.2 U13.5 U14.5 U15.5 U23.2 U24.2 U25.5 U25.6 U26.1 U26.2 U30.5 U30.12 U30.16 U30.25 U31.5 U31.12 U31.16 U31.25 U32.5 U32.12 U32.16 U32.25 U33.1 U33.4 U33.7 U33.10 U33.13 U36.1
L_B_EN: U2.14 U3.8
L_B_EN_IN: R5.2 R60.1 U3.9
R_B_EN: U32.14 U33.8
R_B_EN_IN: R58.1 R75.2 U33.9
$4N16976: Q32.2 Q37.2 R85.2 U13.7 U13.8 U30.21
$4N17009: Q31.2 Q35.2 R84.2 U2.21 U7.7 U7.8
$4N17064: Q26.2 Q29.2 R83.2 U14.7 U14.8 U32.21
$4N17075: Q23.2 Q25.2 R81.2 U15.7 U15.8 U31.21

Pads without a net: CN1 2; J1 1 3 5 7 9 11 13 15; NOREF 1; NOREF#2 1; NOREF#3 1; NOREF#4 1; NOREF#5 1; NOREF#6 1; U2 9 10; U5 1 4; U25 2 8; U26 3 4 7 8 15 16 17 18 19 25 28 30 31 32 33 34 35 53 54 55 56 57 58 60 61 62 74 80 81 84 85 86; U30 9 10; U31 9 10; U32 9 10; U34 1 4

## Via types
v1: diameter 0.61, hole 0.305, Top Layer to Bottom Layer, 617 vias
v2: diameter 1.016, hole 0.61, Top Layer to Bottom Layer, 8 vias

## Routing (per net, layer and track width the routed paths; a pad name or vN(x,y) marks a point on that pad's centre or on a via; arc(x,y) is an arc through that point)
GND: length 39.5
  Top Layer w0.254: U2.16 19.56,13.13 ; C71.1 25.02,8.31 25.02,8.31 ; U2.5 20.56,7.54 ; C77.1 54.23,10.91 54.23,12.24 54.41,12.42 55.76,12.42 v1(55.84,12.5)
  Top Layer w0.305: U31.5 59.87,38.64 v1(60.62,37.89) ; U2.5 20.56,9.33 v1(19.81,10.08) ; U30.16 19.56,38.15 U30.25 ; v1(19.81,10.08) 21.06,11.33 U2.12 ; v1(19.81,10.08) 19.56,10.33 U2.16 ; 58.67,8.83 59.37,8.83 U32.25 ; U32.25 60.87,9.83 U32.16 ; U32.25 59.87,10.83 U32.5 ; v1(60.62,37.89) 60.87,37.64 U31.16 ; v1(60.62,37.89) 59.37,36.64 58.67,36.64 ; U30.5 20.56,37.15 U30.25 ; U30.12 21.06,39.15 U30.25
  Top Layer w0.508: R53.2 36.06,59.71 C20.1 36.01,60.69 35.18,61.52 v2(32.89,61.52)
  vias: v1(2.24,60.43) v1(2.24,59.23) v1(2.24,57.98) v1(3.56,60.43) v1(3.56,59.23) v1(3.56,57.98) v1(3.94,37.77) v1(3.94,31.67) v1(3.94,5.64) v1(4.06,10.59) v1(4.19,4.12) v1(4.87,60.43) v1(4.87,59.23) v1(4.87,57.98) v1(5.72,3.73) v1(12.15,99.3) v1(12.15,98.09) v1(12.15,96.84) v1(12.53,16.56) v1(13.46,99.3) v1(13.46,98.09) v1(13.46,96.84) v1(13.84,16.56) v1(14.56,45.01) v1(14.78,99.3) v1(14.78,98.09) v1(14.78,96.84) v1(14.94,16.56) v1(15.58,1.45) v1(15.88,45.01) v1(16.26,16.56) v1(16.89,1.45) v1(17.19,45.01) v1(18.12,79.36) v1(18.12,78.16) v1(18.12,76.9) v1(18.16,30.02) v1(18.16,24.18) v1(18.16,23.16) v1(18.54,51.53) v1(18.54,50.22) v1(18.54,48.9) v1(19.05,15.8) v1(19.43,79.36) v1(19.43,78.16) v1(19.43,76.9) v1(19.53,37.89) v1(20.75,79.36) v1(20.75,78.16) v1(20.75,76.9) v1(20.7,22.78) v1(21.14,1.45) v1(21.84,22.78) v1(22.45,1.45) v1(22.86,15.42) v1(23,31.1) v1(23.58,12.62) v1(24.89,12.62) v1(25.02,26.72) v1(28.4,80.44) v1(28.91,57.26) v1(28.91,56.06) v1(28.91,54.8) v1(29.04,20.83) v1(29.04,19.86) v1(29.04,18.72) v1(29.72,80.44) v1(30.05,43.61) v1(30.23,57.26) v1(30.23,56.06) v1(30.23,54.8) v1(30.35,20.83) v1(30.35,19.86) v1(30.35,18.72) v1(31.03,80.44) v1(31.37,43.61) v1(31.54,57.26) v1(31.54,56.06) v1(31.54,54.8) v1(31.67,20.83) v1(31.67,19.86) v1(31.67,18.72) v1(32.68,43.61) v1(32.77,31.17) v1(32.77,29.97) v1(32.77,28.71) v1(34.08,31.17) v1(34.08,29.97) v1(34.08,28.71) v1(35.4,31.17) v1(35.4,29.97) v1(35.4,28.71) v1(38.56,97.64) v1(38.56,96.44) v1(38.56,95.19) v1(39.88,97.64) v1(39.88,96.44) v1(39.88,95.19) v1(40.72,39.48) v1(40.72,38.28) v1(40.72,37.02) v1(41.19,97.64) v1(41.19,96.44) v1(41.19,95.19) v1(42.04,39.48) v1(42.04,38.28) v1(42.04,37.02) v1(43.35,39.48) v1(43.35,38.28) v1(43.35,37.02) v1(43.64,45.45) v1(43.64,44.25) v1(43.64,42.99) v1(43.77,31.1) v1(43.77,29.9) v1(43.77,28.64) v1(44.96,45.45) v1(44.96,44.25) v1(44.96,42.99) v1(45.09,31.1) v1(45.09,29.9) v1(45.09,28.64) v1(46.27,45.45) v1(46.27,44.25) v1(46.27,42.99) v1(46.4,31.1) v1(46.4,29.9) v1(46.4,28.64) v1(52.96,62.41) v1(52.96,61.06) v1(52.96,59.66) v1(53.97,45.56) v1(53.97,44.25) v1(53.97,42.93) v1(55.75,27.48) v1(57.15,12.5) v1(57.37,31.43) v1(59.49,23.25) v1(60.03,1.08) v1(60.44,76.71) v1(60.36,10.08) v1(60.45,79.47) v1(60.45,78.16) v1(60.49,23.25) v1(60.71,88.42) v1(60.71,87.11) v1(60.71,85.79) v1(61.34,1.08) v1(62.06,31.55) v1(62.66,1.08) v1(62.87,64.23) v1(62.87,62.92) v1(62.87,61.6) v1(63.36,16.91) v1(65.11,29.13) v1(66.42,29.13) v1(67.74,29.13) v1(68.2,17.7) v1(68.2,16.39) v1(72.22,66.02) v1(72.22,64.82) v1(72.22,63.57) v1(73.53,66.02) v1(73.53,64.82) v1(73.53,63.57) v1(74.85,66.02) v1(74.85,64.82) v1(74.85,63.57) v1(74.88,79.99) v1(74.88,78.79) v1(74.88,77.54) v1(75.39,98.41) v1(75.39,97.21) v1(75.39,95.95) v1(75.95,14.66) v1(75.96,9.45) v1(76.07,37.01) v1(76.07,35.61) v1(76.2,79.99) v1(76.2,78.79) v1(76.2,77.54) v1(76.71,98.41) v1(76.71,97.21) v1(76.71,95.95) v1(77.51,79.99) v1(77.51,78.79) v1(77.51,77.54) v1(78.02,98.41) v1(78.02,97.21) v1(78.02,95.95)
PGND: length 90.2
  Top Layer w0.254: U2.20 15.67,10.83 v1(14.95,10.12) ; C19.1 v1(34.42,69.39) ; U32.20 64.65,9.33 v1(65.41,10.08) ; v1(15.02,37.67) 15.99,38.65 U30.20 ; v1(65.41,37.9) 64.65,37.14 U31.20
  Top Layer w0.381: U12.9 45.03,58.51 U12.3
  Top Layer w0.508: 34.8,63.42 34.29,63.93 R18.1 32.64,64.69 v1(32.64,66.22) 32.26,66.6 U21.2
  Bottom Layer w0.254: R81.1 73.15,39.67 73.41,39.93 73.41,41.45 72.9,41.96 65.79,41.96 65.15,41.33 65.15,38.15 v1(65.41,37.9) ; R83.1 73.28,12.12 73.53,12.37 73.53,14.15 73.28,14.4 66.29,14.4 65.18,13.28 65.18,10.31 v1(65.41,10.08) ; R84.1 6.94,8.18 6.68,7.93 6.68,6.7 7.54,5.84 15.02,5.84 15.28,6.1 15.28,9.79 v1(14.95,10.12) ; R85.1 6.88,35.23 6.63,34.98 6.63,33.43 7.05,33.01 15.05,33.01 15.3,33.26 15.3,37.39 v1(15.02,37.67)
  vias: v1(1.14,45.14) v1(1.22,23.42) v1(1.67,53.56) v1(1.67,52.25) v1(1.67,50.93) v1(2.54,23.42) v1(3.94,41.51) v1(3.94,40.74) v1(3.94,39.8) v1(3.86,23.42) v1(4.06,45.14) v1(5.08,26.13) v1(5.08,24.82) v1(5.08,23.5) v1(7.87,53.26) v1(9.33,34.72) v1(9.39,7.16) v1(9.65,48.69) v1(10.15,34.59) v1(10.39,7.16) v1(11.89,27.03) v1(11.89,25.83) v1(11.89,24.58) v1(11.89,1.45) v1(13.21,27.03) v1(13.21,25.83) v1(13.21,24.58) v1(13.21,1.45) v1(14.1,47.93) v1(14.1,46.53) v1(14.52,27.03) v1(14.52,25.83) v1(14.52,24.58) v1(14.52,1.45) v1(24.88,24.48) v1(24.88,23.16) v1(28.53,9.13) v1(28.53,7.93) v1(28.53,6.67) v1(28.53,5.06) v1(28.53,3.86) v1(28.53,2.61) v1(29.29,86.54) v1(29.84,9.13) v1(29.84,7.93) v1(29.84,6.67) v1(29.84,5.06) v1(29.84,3.86) v1(29.84,2.61) v1(30.61,86.54) v1(31.16,9.13) v1(31.16,7.93) v1(31.16,6.67) v1(31.16,5.06) v1(31.16,3.86) v1(31.16,2.61) v1(31.92,86.54) v1(35.39,86.54) v1(36.7,86.54) v1(38.02,86.54) v1(38.1,61.56) v1(38.1,60.25) v1(38.1,58.93) v1(38.06,58.03) v1(38.06,57.07) v1(39.37,58.03) v1(39.37,57.07) v1(40.47,82.86) v1(40.47,79.55) v1(40.69,58.03) v1(40.69,57.07) v1(41.78,82.86) v1(41.78,79.55) v1(47.24,54.03) v1(54.61,23.16) v1(55.93,23.16) v1(57.4,3.65) v1(57.4,2.34) v1(57.4,1.02) v1(65.23,1.32) v1(65.94,26.85) v1(65.94,25.65) v1(65.94,24.39) v1(66.55,1.32) v1(67.26,26.85) v1(67.26,25.65) v1(67.26,24.39) v1(67.86,1.32) v1(68.57,26.85) v1(68.57,25.65) v1(68.57,24.39) v1(69.85,48.18) v1(69.82,11.48) v1(70.04,38.28) v1(70.68,11.48) v1(70.88,38.28) v1(74.04,26.26) v1(74.04,24.94) v1(74.04,23.63) v1(75.27,23.63) v1(76.58,23.63) v1(77.47,49.33) v1(77.9,23.63) v1(78.83,52.58) v1(79.25,45.9)
VCC3V3: length 20.7
  Top Layer w0.254: v1(16.64,94.28) 16.65,94.27 R30.2 ; R29.2 23.65,94.26 v1(23.62,94.28) ; R27.2 v1(58.68,94.41) ; R16.2 v1(14.1,56.69) ; R43.2 v1(75.82,91.24) ; R42.2 v1(65.66,91.24) ; R28.2 v1(51.82,94.41)
  Top Layer w0.508: 62.34,72.28 v2(60.94,72.28)
  Top Layer w0.635: U7.2 5.72,11.61 v2(3.43,11.61) ; U14.2 v2(76.58,7.2) ; v2(3.34,38.77) 5.63,38.77 5.72,38.86 ; 74.2,34.25 v2(76.58,34.25)
  vias: v1(46.99,86.16) v1(46.99,84.69) v1(46.99,83.23) v1(46.99,81.77) v1(46.99,80.31) v1(46.99,78.84) v1(48.39,86.16) v1(48.39,84.7) v1(48.39,83.24) v1(48.39,81.77) v1(48.39,80.31) v1(48.39,78.85) v1(49.58,86.16) v1(49.58,84.69) v1(49.58,83.23) v1(49.58,81.77) v1(49.58,80.31) v1(49.58,78.84)
VCC5V: length 1.5
  Top Layer w0.508: 47.12,57.84 47,57.71 U12.4
VCC5V_EXT: length 5.6
  Top Layer w0.254: R17.2 v1(12.19,60.76)
  vias: v1(27.56,69.52) v1(27.56,68.14) v1(27.56,66.77) v1(27.56,65.39) v1(27.56,64.01) v1(28.59,69.52) v1(28.59,68.14) v1(28.59,66.77) v1(28.59,65.39) v1(28.59,64.01) v1(29.96,69.52) v1(29.96,68.14) v1(29.96,66.77) v1(29.96,65.39) v1(29.96,64.01)
VCCBAT: length 10.8
  Top Layer w0.508: R90.1 v2(69.72,47.04) ; R51.1 36.06,54.67 36.7,54.03 42.16,54.03 v1(42.29,54.15)
  Top Layer w0.635: R89.1 v2(11.18,46.79)
  vias: v1(8,21.77) v1(8,20.54) v1(8,19.3) v1(9.45,21.77) v1(9.45,20.54) v1(9.45,19.3) v1(10.94,21.77) v1(10.94,20.54) v1(10.94,19.3) v1(11.43,35.48) v1(11.43,33.71) v1(11.56,7.93) v1(11.57,6.43) v1(11.69,39.52) v1(11.68,37.64) v1(11.94,10.59) v1(11.94,9.85) v1(12.32,21.73) v1(12.32,20.5) v1(12.32,19.27) v1(12.52,35.48) v1(12.52,34.61) v1(12.51,33.71) v1(12.76,39.52) v1(12.76,38.56) v1(12.75,37.64) v1(12.83,11.4) v1(12.83,10.59) v1(12.83,9.85) v1(12.77,7.93) v1(12.77,7.16) v1(12.77,6.43) v1(13.72,34.15) v1(13.73,11.4) v1(13.73,10.59) v1(13.73,9.85) v1(13.79,39.52) v1(13.8,38.56) v1(13.8,37.64) v1(13.84,6.76) v1(13.94,21.73) v1(13.94,20.5) v1(13.94,19.27) v1(14.57,34.15) v1(42.29,53.38) v1(42.29,52.57) v1(43.45,54.15) v1(43.45,53.38) v1(43.45,52.57) v1(44.61,54.15) v1(44.61,53.38) v1(44.61,52.57) v1(45.25,20.34) v1(45.25,18.9) v1(45.25,17.44) v1(45.77,54.15) v1(45.77,53.38) v1(45.77,52.57) v1(46.54,20.34) v1(46.54,18.9) v1(46.54,17.44) v1(47.82,20.34) v1(47.82,18.9) v1(47.82,17.44) v1(49.11,20.35) v1(49.11,18.91) v1(49.11,17.45) v1(50.4,20.35) v1(50.4,18.91) v1(50.4,17.45) v1(65.41,35.61) v1(65.41,34.59) v1(65.91,9.07) v1(65.91,8.36) v1(65.9,7.63) v1(66.03,21.35) v1(66.03,20.12) v1(66.03,19.14) v1(66.32,41.08) v1(66.31,35.61) v1(66.31,34.59) v1(66.29,13.26) v1(66.86,9.07) v1(66.87,8.36) v1(66.87,7.63) v1(67.22,35.61) v1(67.22,34.59) v1(67.22,13.26) v1(67.21,12.37) v1(67.21,11.28) v1(67.31,38.86) v1(67.44,41.33) v1(67.44,40.58) v1(67.44,39.7) v1(67.48,21.35) v1(67.48,20.12) v1(67.48,19.14) v1(67.77,9.07) v1(68.05,13.26) v1(68.13,35.61) v1(68.07,12.37) v1(68.42,41.38) v1(68.42,40.58) v1(68.42,39.68) v1(68.59,9.07) v1(68.9,13.26) v1(68.9,12.43) v1(68.96,21.35) v1(68.96,20.12) v1(68.96,19.14) v1(70.34,21.31) v1(70.34,20.08) v1(70.34,19.1) v1(71.97,21.31) v1(71.97,20.08) v1(71.97,19.1)
B3: length 57.5
  Top Layer w0.254: 19.81,47.3 18.09,47.3 16.72,48.67 16.72,57.51 16.74,57.53 16.74,64.4 14.56,66.57 11.18,66.57 7.34,70.42 7.34,74.78 v1(7.92,75.36)
  Bottom Layer w0.254: 19.81,47.3 20.39,47.3 21.19,46.49 29.52,46.49 29.93,46.9 30.78,46.9 31.38,47.5 31.38,49.44 30.35,50.47 ; CN1.6 11.43,75.36 v1(7.92,75.36)
  vias: v1(19.69,47.3)
B4: length 49.4
  Top Layer w0.254: 19.81,48.06 17.91,48.06 17.14,48.82 17.14,64.57 14.73,66.98 11.35,66.98 7.92,70.41 v1(7.92,72.73)
  Bottom Layer w0.254: 19.81,48.06 20.2,48.06 21.36,46.9 28.24,46.9 28.25,46.91 29.34,46.91 30.35,47.93 ; CN1.10 11.57,72.68 7.98,72.68 v1(7.92,72.73)
  vias: v1(19.69,48.06)
B5: length 48
  Top Layer w0.254: J1.12 69.09,50.47 69.09,48.56 68.58,48.06 64.39,48.06 63.12,49.33 52.32,49.33 51.82,49.83 51.82,50.98 51.29,51.5 28.72,51.5 U26.36
B12: length 51.4
  Top Layer w0.254: R82.1 53.47,37.01 53.09,37.39 53.09,41.2 v1(52.45,41.83) ; v1(25.3,42.22) 23.24,42.22 21.46,43.99 21.46,52.12 22.35,53.01 22.73,53.01 ; v1(37.85,41.83) v1(49.91,41.83)
  Bottom Layer w0.254: v1(37.85,41.83) 37.52,42.16 25.35,42.16 v1(25.3,42.22) ; v1(49.91,41.83) v1(52.45,41.83) ; C89.1 22.73,53.01
B14: length 80.7
  Top Layer w0.254: v1(37.85,41.07) 49.66,41.07 50.19,40.54 50.19,28.98 52.15,27.03 52.15,17.56 53.49,16.22 53.49,9.69 53.98,9.19 R86.1 ; v1(25.27,41.45) 25.26,41.45 25.13,41.58 23.3,41.58 21.06,43.82 21.06,54.25 22.35,55.55 22.73,55.55
  Bottom Layer w0.254: C90.1 21.12,57.16 22.73,55.55 ; v1(25.27,41.45) 37.4,41.45 37.6,41.25 37.67,41.25 v1(37.85,41.07)
B15: length 58.4
  Top Layer w0.254: R87.1 26.03,18.45 26.75,19.17 26.75,32.77 v1(27.56,33.58) ; v1(27.55,39.48) 27.55,44.13 27.08,44.6 24.54,44.6 23.88,45.26 23.88,56.69 25.27,58.09
  Bottom Layer w0.254: v1(27.55,39.48) 27.55,33.59 v1(27.56,33.58) ; C91.1 23.83,59.53 25.27,58.09
B17: length 32.3
  Top Layer w0.254: 25.27,60.63 26.42,59.49 26.42,45.39 26.8,45.01 27.31,45.01 28.19,44.12 28.19,39.29 27.56,38.66 R88.1
  Bottom Layer w0.254: C92.1 24,61.9 25.27,60.63
B18: length 28.9
  Top Layer w0.254: CN1.3 8.51,77.52 8.51,70.4 11.52,67.39 14.9,67.39 17.59,64.69 20.63,64.69 21.35,63.98 21.35,62.01 22.73,60.63
B19: length 24.1
  Top Layer w0.254: 25.27,63.17 24.13,64.31 22.16,64.31 20.97,65.51 17.93,65.51 14.22,69.21 14.22,77.65 CN1.4
B20: length 23.5
  Top Layer w0.254: 22.73,63.17 20.8,65.1 17.76,65.1 15.07,67.79 11.69,67.79 8.92,70.57 8.92,75.39 CN1.5
B21: length 27.5
  Top Layer w0.254: 25.27,65.71 24.11,66.88 17.14,66.88 14.63,69.38 14.63,79.27 13.54,80.37 11.5,80.37 CN1.1
B27: length 25.2
  Top Layer w0.254: C20.2 34.38,60 27.43,60 26.54,60.88 26.54,72.06 25.27,73.33
  Top Layer w0.508: R51.2 34.61,56.14 C20.2
B28: length 66.7
  Bottom Layer w0.254: 22.73,73.33 23.88,72.19 34.16,72.19 35.81,70.54 35.81,56.19 37.21,54.79 50.16,54.79 50.42,54.53 55.19,54.53 55.2,54.52 63.6,54.52 64.84,55.77 68.18,55.77 68.87,56.46 68.87,58.31 J1.6
B29: length 62.4
  Top Layer w0.254: v1(50.8,55.32) 54.25,51.87 63.48,51.87 64.66,50.69 66.33,50.69 J1.14
  Bottom Layer w0.254: U26.12 25.27,75.74 25.27,75.23 27.91,72.59 34.33,72.59 36.22,70.7 36.22,56.35 37.38,55.19 50.67,55.19 v1(50.8,55.32)
B30: length 65.6
  Bottom Layer w0.254: U26.11 23.88,77.14 25.84,77.14 26.64,76.34 26.64,74.43 28.08,73 34.5,73 36.63,70.87 36.63,56.52 37.55,55.6 50.15,55.6 50.46,55.91 51.42,55.91 52.1,56.58 61.91,56.58 63.46,58.13 66.51,58.13 J1.8
B31: length 63.4
  Top Layer w0.254: v1(50.8,56.52) 51.23,56.52 53.23,54.52 63.26,54.52 64.55,53.23 66.51,53.23 J1.10
  Bottom Layer w0.254: v1(50.8,56.52) 50.47,56.52 49.96,56.01 37.72,56.01 37.03,56.69 37.03,71.04 34.67,73.41 28.25,73.41 27.05,74.6 27.05,76.5 U26.10
C0: length 92.2
  Top Layer w0.254: v1(53.34,31.8) 54.43,30.71 63.93,30.71 v1(64.39,31.17) ; U15.4 v1(72.39,37.25)
  Bottom Layer w0.254: v1(64.39,31.17) 68.07,31.17 69.72,32.82 70.99,32.82 71.37,33.2 71.37,36.23 v1(72.39,37.25) ; v1(53.34,31.8) 53.09,32.05 53.09,35.12 53.38,35.41 55.04,35.41 56.82,37.19 56.82,44.17 57.3,44.65 69.1,44.65 70.92,46.47 70.92,65.35 69.3,66.97 66.69,66.97 66.5,67.16 66.5,69.77 65.28,70.99 60.99,70.99 58.65,73.33 58.29,73.33
C1: length 94.8
  Top Layer w0.254: v1(52.58,31.67) 53.97,30.28 v1(64.39,30.28) ; v1(72.39,36.12) 72.76,35.75 U15.3
  Bottom Layer w0.254: 55.75,73.33 57.02,72.06 59.35,72.06 60.82,70.59 65.11,70.59 66.09,69.6 66.09,66.81 66.34,66.56 69.13,66.56 70.51,65.18 70.51,46.72 70.41,46.61 70.41,46.53 68.93,45.06 57.13,45.06 56.41,44.34 56.41,37.35 54.87,35.81 53.21,35.81 52.58,35.18 v1(52.58,31.67) ; v1(72.39,36.12) 71.78,35.51 71.78,33.03 71.16,32.41 69.89,32.41 68.24,30.76 64.87,30.76 v1(64.39,30.28)
C2: length 116.2
  Top Layer w0.254: U14.4 v1(72.39,10.2) ; v1(57.34,7.35) 56.39,8.31 53.77,8.31 53.08,9 53.08,16.05 51.74,17.39 51.74,26.86 49.78,28.81 49.78,33.07 v1(49.21,33.64)
  Bottom Layer w0.254: v1(57.34,7.35) 59.38,5.31 66.69,5.31 71.58,10.2 v1(72.39,10.2) ; v1(49.21,33.64) 49.21,35.52 49.91,36.22 54.71,36.22 56.01,37.52 56.01,44.51 56.96,45.46 68.4,45.46 68.87,45.93 68.87,48.09 70,49.23 70,65.12 68.97,66.15 66.17,66.15 65.68,66.64 65.68,69.43 64.94,70.18 60.4,70.18 59.79,70.79 58.29,70.79
C3: length 118.9
  Top Layer w0.254: U14.3 72.89,8.7 v1(72.39,9.19) ; v1(48.26,33.58) 49.38,32.46 49.38,28.65 51.33,26.69 51.33,17.22 52.67,15.89 52.67,8.83 53.6,7.9 55.88,7.9 57.15,6.63 v1(57.15,6.53)
  Bottom Layer w0.254: v1(72.39,9.19) 71.16,9.19 66.86,4.9 59.22,4.9 57.59,6.53 v1(57.15,6.53) ; 55.75,70.79 55.75,70.66 56.64,69.77 57.85,69.77 57.87,69.76 58.72,69.76 58.73,69.77 64.77,69.77 65.28,69.27 65.28,66.47 66,65.75 68.8,65.75 69.6,64.95 69.6,49.58 68.87,48.86 68.87,48.84 68.12,48.09 64.41,48.09 63.75,47.44 63.75,46.53 63.09,45.87 56.8,45.87 55.6,44.68 55.6,37.69 54.54,36.63 49.28,36.63 48.26,35.61 v1(48.26,33.58)
C5: length 80.9
  Top Layer w0.254: 55.75,68.25 53.47,68.25 52.43,69.29 52.43,89.5 50.2,91.72 30.57,91.72 30.12,92.17 30.12,94.48 27.02,97.59 17.39,97.59 13.71,93.9 3.68,93.9 2.41,92.63 U25.4
C6: length 84.8
  Top Layer w0.254: U25.1 4.83,90.86 7.06,93.09 14.05,93.09 16.26,95.3 28.16,95.3 29.3,94.16 29.3,91.83 30.23,90.91 49.87,90.91 51.61,89.16 51.61,65.28 52.58,64.31 56.9,64.31 58.29,65.71
C7: length 79.3
  Top Layer w0.254: U25.3 5.69,93.5 13.88,93.5 16.09,95.71 28.32,95.71 29.72,94.31 29.72,92 30.4,91.31 50.03,91.31 52.02,89.33 52.02,66.6 52.91,65.71 55.75,65.71
C8: length 41.7
  Top Layer w0.254: R47.2 63.24,91.7 62.61,91.08 55.15,91.08 53.24,89.16 53.24,71.02 53.72,70.54 v1(53.72,69.01)
  Bottom Layer w0.254: 58.29,63.17 57.02,64.44 54.61,64.44 53.72,65.33 v1(53.72,69.01)
C9: length 33.8
  Top Layer w0.254: v1(53.09,69.77) 53.09,70.54 52.83,70.79 52.83,89.37 53.07,89.61 53.11,89.61 54.99,91.49 56.13,91.49 56.38,91.74 R48.2
  Bottom Layer w0.254: 55.75,63.17 54.48,63.17 53.09,64.57 v1(53.09,69.77)
C10: length 24.6
  Top Layer w0.254: P4.3 75.84,67.21 61.89,67.21 61.19,66.5 61.19,61.74 v1(60.07,60.63)
  Bottom Layer w0.254: 58.29,60.63 v1(60.07,60.63)
C11: length 30.7
  Top Layer w0.254: 55.75,60.63 57.26,62.14 59.3,62.14 59.97,62.81 59.97,67.01 61.39,68.43 74.41,68.43 75.72,69.74 75.72,71.84 76.96,73.08 P4.6
C12: length 26.6
  Top Layer w0.254: P4.4 75.95,67.62 61.72,67.62 60.78,66.67 60.78,62.44 60.75,62.44 59.44,61.13 59.44,59.23 58.29,58.09
C13: length 30.6
  Top Layer w0.254: 55.75,58.09 57.02,59.36 57.02,61.14 57.62,61.73 59.46,61.73 60.37,62.64 60.37,66.84 61.56,68.02 74.58,68.02 76.96,70.41 P4.5
C14: length 64.1
  Top Layer w0.254: R49.2 28.19,92.77 28.19,92.36 30.06,90.5 49.7,90.5 51.21,88.99 51.21,57.94 52.45,56.69 57.15,56.69 58.29,55.55
C15: length 68.3
  Top Layer w0.254: 55.75,55.55 55.75,55.68 55.5,55.93 52.77,55.93 52.41,56.29 52.28,56.29 50.8,57.77 50.8,57.9 50.67,58.02 50.67,88.95 49.53,90.09 29.89,90.09 27.98,92 22.22,92 21.33,92.89 R50.2
C21: length 11.1
  Top Layer w0.254: U26.59 61.34,47.93 63.75,45.52 66.42,45.52 J1.16
C28: length 29.7
  Top Layer w0.254: v1(60.45,31.67) 60.45,32.28 59.91,32.82 52.32,32.82 51.82,33.33 51.82,44.57 49.16,47.23 49.16,49.44 48.13,50.47
  Bottom Layer w0.254: R56.2 60.45,30.34 v1(60.45,31.67)
C29: length 22.2
  Top Layer w0.254: v1(55.63,31.29) 54.51,32.41 52.16,32.41 51.41,33.16 51.41,44.41 48.13,47.68 48.13,47.93
  Bottom Layer w0.254: R55.1 55.63,30.22 v1(55.63,31.29)
C30: length 45.1
  Top Layer w0.254: v1(60.32,17.2) 60.07,17.45 53.41,17.45 52.96,17.9 52.96,27.36 51,29.32 51,44.24 48.45,46.79 47.37,46.79 46.74,47.42 46.74,49.33 45.59,50.47
  Bottom Layer w0.254: v1(60.32,17.2) 60.93,16.59 R58.2
C31: length 38.2
  Top Layer w0.254: 45.59,47.93 45.59,47.23 46.44,46.38 48.29,46.38 50.6,44.07 50.6,29.15 52.55,27.19 52.55,17.73 53.59,16.69 v1(54.99,16.69)
  Bottom Layer w0.254: R57.1 55.07,16.61 v1(54.99,16.69)
CR: length 36.4
  Top Layer w0.254: U21.4 33.94,66.06 32.64,67.36 v1(32.64,77.27) ; 42.95,76.08 v1(42.95,75.11)
  Bottom Layer w0.254: 22.73,78.41 23.75,79.43 24.83,79.43 24.85,79.44 25.7,79.44 25.71,79.43 26.92,79.43 29.08,77.27 v1(32.64,77.27) 42.16,77.27 42.93,76.5 42.93,75.13 v1(42.95,75.11)
D0: length 71.3
  Top Layer w0.254: H1.3 4.24,73.91 4.24,68.81 8.1,64.95 13.89,64.95 15.08,63.76 15.08,56.85 15.1,56.84 15.1,47.99 18.84,44.25 v1(19.69,44.25)
  Bottom Layer w0.254: 43.05,50.47 44.08,49.44 44.08,47.5 43.17,46.6 42.29,46.6 40.48,44.78 22,44.78 21.64,44.42 19.86,44.42 v1(19.69,44.25)
D1: length 68.9
  Top Layer w0.254: H1.4 3.12,78.03 4.65,76.5 4.65,68.98 8.27,65.35 14.06,65.35 15.49,63.93 15.49,57.02 15.5,57 15.5,48.16 18.66,45.01 v1(19.69,45.01)
  Bottom Layer w0.254: 43.05,47.93 40.31,45.19 19.86,45.19 v1(19.69,45.01)
D2: length 72
  Top Layer w0.254: v1(19.69,45.77) 18.47,45.77 15.91,48.33 15.91,64.08 14.23,65.76 8.44,65.76 5.05,69.15 5.05,78.18 H1.5
  Bottom Layer w0.254: 40.51,50.47 41.54,49.44 41.54,47.5 39.81,45.77 38.93,45.77 38.84,45.68 19.77,45.68 v1(19.69,45.77)
D3: length 69.6
  Top Layer w0.254: 19.81,46.53 18.28,46.53 16.32,48.5 16.32,64.25 14.4,66.17 8.61,66.17 5.46,69.31 5.46,80.31 H1.6
  Bottom Layer w0.254: 19.81,46.53 20.57,46.53 21.02,46.09 29.69,46.09 29.75,46.15 38.74,46.15 40.51,47.93
  vias: v1(19.69,46.53)
D4: length 46.6
  Top Layer w0.254: v1(24.74,16.18) 24.74,17.73 26.34,19.34 26.34,33.49 27.01,34.16 35.46,34.16 37.26,35.97 37.26,45.76 39,47.5 39,49.44 37.97,50.47
  Bottom Layer w0.254: R60.2 24.74,17.17 v1(24.74,16.18)
D5: length 47.3
  Top Layer w0.254: 37.97,47.93 36.86,46.81 36.86,36.14 35.29,34.57 26.84,34.57 25.93,33.66 25.93,19.51 24.13,17.7 20.7,17.7 20.45,17.45 20.45,16.12 v1(20.38,16.05)
  Bottom Layer w0.254: R59.1 20.45,16.12 v1(20.38,16.05)
D6: length 31.1
  Top Layer w0.254: v1(24.89,31.67) 25.12,31.9 25.12,34.12 26.39,35.38 34.95,35.38 36.04,36.47 36.04,45.54 34.28,47.31 34.28,49.69 35.05,50.47 35.43,50.47
  Bottom Layer w0.254: v1(24.89,31.67) R62.2
D7: length 35
  Top Layer w0.254: v1(20.13,31.55) 20.13,30.59 20.7,30.02 24.51,30.02 25.53,31.04 25.53,33.95 26.56,34.98 35.12,34.98 36.45,36.31 36.45,46.91 35.43,47.93
  Bottom Layer w0.254: R61.1 20.13,30.46 v1(20.13,31.55)
D8: length 62.3
  Top Layer w0.254: v1(47.88,56.69) v1(47.88,52.88) ; R24.2 v1(65.66,82.98)
  Bottom Layer w0.254: v1(65.66,82.98) 65.66,78.92 64.12,77.38 55.17,77.38 52.72,74.93 49.16,74.93 47.88,73.65 v1(47.88,56.69) ; v1(47.88,52.88) 46.98,51.98 34.28,51.98 U26.40
D9: length 74.1
  Top Layer w0.254: R46.2 75.82,84.51 v1(75.82,82.98) ; v1(48.51,57.45) v1(48.51,53.39)
  Bottom Layer w0.254: U26.39 33.91,49.07 33.91,50.53 34.96,51.58 47.4,51.58 48.46,52.64 48.46,53.34 v1(48.51,53.39) ; v1(75.82,82.98) 67.21,82.98 66.07,81.84 66.07,78.75 63.31,76 60.22,76 58.75,74.52 49.33,74.52 48.51,73.71 v1(48.51,57.45)
D13: length 104.5
  Top Layer w0.254: v1(16.13,69.77) 15.95,69.95 15.95,70.02 15.77,70.19 15.77,89.93 17.03,91.19 27.65,91.19 29.55,89.28 46.95,89.28 v1(47.13,89.1) ; U13.4 6.64,35.75 v1(8.01,37.12)
  Bottom Layer w0.254: v1(47.13,89.1) 47.13,88.94 47.14,88.93 48.25,88.93 48.37,89.05 53.37,89.05 54.88,87.54 57.26,87.54 58.29,88.57 ; v1(16.13,69.77) 15.95,69.6 15.95,69.16 13.67,66.87 13.67,60.46 12.37,59.17 12.37,41.1 8.39,37.12 v1(8.01,37.12)
D14: length 100.3
  Top Layer w0.254: v1(48.01,89.51) 47.55,89.51 47.37,89.69 29.72,89.69 27.82,91.59 16.87,91.59 15.37,90.09 v1(15.37,69.77) ; v1(7.53,37.72) 7.06,37.25 U13.3
  Bottom Layer w0.254: v1(48.01,89.51) 54.81,89.51 55.75,88.57 ; v1(15.37,69.77) 15.37,69.15 13.26,67.04 13.26,60.87 11.96,59.57 11.96,41.27 8.41,37.72 v1(7.53,37.72)
D15: length 162
  Top Layer w0.254: v1(24.51,40.82) 23.49,40.82 20.67,43.64 14.39,43.64 v1(13.38,44.65) ; v1(45.72,88.19) 45.44,88.47 29.22,88.47 27.31,90.37 17.37,90.37 16.59,89.59 16.59,70.9 17.47,70.02 17.47,69.95 v1(17.65,69.77) ; U7.4 7,8.7 v1(7.37,9.07) ; v1(29.84,33.45) 29,32.61 28.41,32.61 27.56,31.76 27.56,15.29 v1(27.43,15.16)
  Bottom Layer w0.254: U26.88 57.02,84.89 55.25,84.89 54.41,85.72 54.41,86.37 54.36,86.42 54.36,86.67 52.78,88.24 48.71,88.24 48.41,87.94 45.97,87.94 v1(45.72,88.19) ; v1(7.37,9.07) 10.28,11.98 13.97,11.98 14.09,11.86 14.1,11.86 14.35,11.61 21.74,11.61 22.63,12.5 22.63,13.35 23.03,13.75 26.02,13.75 v1(27.43,15.16) ; v1(29.84,33.45) 29.84,36.12 29.21,36.75 29.21,39.93 28.37,40.77 24.56,40.77 v1(24.51,40.82) ; v1(17.65,69.77) 17.65,69.71 14.48,66.53 14.48,60.13 13.18,58.83 13.18,44.84 v1(13.38,44.65)
D16: length 156.5
  Top Layer w0.254: v1(28.69,33.46) 27.15,31.93 27.15,19 26.67,18.52 v1(26.67,15.29) ; v1(26.42,40.18) 23.55,40.18 20.5,43.23 13.72,43.23 v1(12.95,43.99) ; U7.3 v1(7.37,10.2) ; v1(46.47,88.69) 46.16,88.69 45.97,88.88 29.38,88.88 27.48,90.78 17.2,90.78 16.18,89.76 16.18,70.55 16.71,70.02 16.71,69.95 v1(16.89,69.77)
  Bottom Layer w0.254: v1(12.95,43.99) 12.78,44.17 12.78,59 14.07,60.3 14.07,66.7 16.89,69.52 v1(16.89,69.77) ; v1(26.42,40.18) 28.19,40.18 28.69,39.69 v1(28.69,33.46) ; v1(26.67,15.29) 25.53,14.15 22.86,14.15 22.22,13.52 22.22,12.67 21.57,12.01 14.52,12.01 14.27,12.27 14.26,12.27 14.14,12.39 9.56,12.39 v1(7.37,10.2) ; v1(46.47,88.69) 46.76,88.39 48.29,88.39 48.54,88.65 53.14,88.65 55.75,86.03
D20: length 91.4
  Top Layer w0.254: CN2.4 10.23,64.19 8.45,64.19 8.42,64.21 8.26,64.21 3.72,68.76 2.22,68.76 1.14,69.84 1.14,84.38 1.52,84.76 6.6,84.76 7.18,84.18 7.31,84.18 v1(7.49,84)
  Bottom Layer w0.254: 55.75,80.95 53.59,83.11 53.59,86.03 52.51,87.11 42.86,87.11 42.53,86.78 42.53,85 41.88,84.35 27.79,84.35 25.91,82.47 25.71,82.47 25.7,82.46 22.18,82.46 20.64,84 v1(7.49,84)
D21: length 93.6
  Top Layer w0.254: CN2.3 9.5,62.56 8.25,63.81 8.1,63.81 3.55,68.35 2.06,68.35 0.74,69.67 0.74,84.61 1.4,85.27 6.92,85.27 v1(7.43,84.76)
  Bottom Layer w0.254: v1(7.43,84.76) 41.72,84.76 42.12,85.17 42.12,86.94 42.69,87.52 52.68,87.52 54,86.2 54,83.28 55.06,82.22 56.39,82.22 57.02,81.58 57.02,79.93 58.29,78.66 58.29,78.41
D24: length 8.8
  Top Layer w0.254: 55.75,75.87 57.28,74.35 57.85,74.35 57.87,74.36 58.72,74.36 58.73,74.35 R13.2 R19.1
L_3V3: length 6.1
  Top Layer w0.508: U5.3 U5.6
L_B_A: length 12.6
  Top Layer w0.254: 9.67,6.21 9.52,6.21 8.51,7.22 8.51,8.32 9.25,9.07 15.91,9.07 16.08,8.9 16.85,8.9 17.28,9.33 U2.23
L_B_B: length 10.6
  Top Layer w0.254: 9.97,11.54 10.69,12.26 10.69,12.87 11.05,13.23 18.16,13.23 18.56,12.83 U2.18
L_B_EN: length 15
  Top Layer w0.254: v1(21.3,14.56) 20.56,13.82 U2.14
  Bottom Layer w0.254: v1(21.3,14.56) 25.05,14.56 25.65,15.16 25.65,19.1 25.19,19.56 23.79,19.56 23.29,20.07 U3.8
L_B_EN_IN: length 4.5
  Bottom Layer w0.254: U3.9 22.64,18.94 R5.2
  Bottom Layer w0.508: R5.2 24.97,18.66 25.02,18.71
L_B_PH: length 9.4
  Top Layer w0.254: v1(20.07,14.15) 20.07,12.03 U2.15
  Bottom Layer w0.254: v1(20.07,14.15) 21.34,15.42 U3.11
L_B_PH_IN: length 4.6
  Bottom Layer w0.254: U3.12 20.69,18.94 20.45,18.7
  Bottom Layer w0.508: 18.16,18.7 20.45,18.7
L_DVDD: length 26.8
  Top Layer w0.254: U30.8 21.77,37.14 v1(22.99,37.14) 24.32,37.14 C69.2
  Bottom Layer w0.254: U3.14 19.43,20.92 19.43,22.62 20.61,23.8 25.65,23.8 26.01,24.16 26.01,32 25.97,32 25.1,32.86 23.7,32.86 22.99,33.58 v1(22.99,37.14)
L_F_A: length 12.6
  Top Layer w0.254: Q33.2 8.51,34.55 8.51,36.01 9.25,36.75 16.95,36.75 17.34,37.15 U30.23
L_F_B: length 11.8
  Top Layer w0.254: U30.18 18.56,40.39 18.41,40.54 11.05,40.54 10.32,39.81 10.32,39.02 9.78,38.48 9.78,37.95 Q36.2
L_F_EN: length 22.4
  Top Layer w0.254: U30.14 v1(20.56,41.07)
  Bottom Layer w0.254: v1(20.56,41.07) 20.56,36.83 20.57,36.82 20.57,33.2 21.31,32.46 24.93,32.46 25.6,31.79 25.6,28.37 25.19,27.96 22.86,27.96 22.68,27.78 22.68,26.77 22.64,26.72
L_F_EN_IN: length 4.6
  Bottom Layer w0.254: 21.99,26.72 21.99,27.88 R69.1
  Bottom Layer w0.508: R69.1 24.93,28.8 25.02,28.89
L_F_PH: length 16.5
  Top Layer w0.254: v1(19.69,41.07) 20.07,40.69 20.07,39.84 U30.15
  Bottom Layer w0.254: v1(19.69,41.07) 19.69,40.56 20.16,40.09 20.16,33.04 21.08,32.12 21.08,27.51 20.69,27.12 20.69,26.72
L_F_PH_IN: length 4.7
  Bottom Layer w0.254: 20.45,28.89 20.45,28.75 19.94,28.25 19.94,27.99 20.04,27.89 20.04,26.72
  Bottom Layer w0.508: R68.1 20.33,28.77 20.45,28.89
L_NSLEEP: length 71.4
  Top Layer w0.254: v1(21.15,13.15) 21.06,13.06 U2.13 ; U30.13 21.08,39.86 21.08,40.77 21.21,40.89 21.21,41.42 20.35,42.28 v1(17.31,42.28) 12.77,42.28 12.06,42.98 12.06,47.04 10.92,48.18 10.92,54.15 9.91,55.16 R93.1 9.78,56.19 9.49,56.48 4.06,56.48 3.81,56.22 U5.2
  Top Layer w0.508: U5.5 U5.2
  Bottom Layer w0.254: v1(21.15,13.15) 20.88,13.42 19.97,13.42 17.19,16.19 17.19,31.45 17.35,31.6 17.35,42.24 v1(17.31,42.28)
R_3V3: length 6.1
  Top Layer w0.508: U34.3 U34.6
R_B_A: length 11.7
  Top Layer w0.254: U32.23 63.31,10.83 63.57,11.09 64.02,11.09 64.41,10.7 65.74,10.7 66.54,9.9 71.05,9.9 71.37,10.22 71.37,12.37
R_B_B: length 10.2
  Top Layer w0.254: U32.18 61.87,7.42 62.36,6.93 68.94,6.93 70.31,8.3 Q27.2
R_B_EN: length 22
  Top Layer w0.254: U32.14 v1(59.87,6.53)
  Bottom Layer w0.254: U33.8 61.47,20.59 61.47,19.48 61.85,19.1 64.13,19.1 64.39,18.85 64.39,15.57 63.99,15.16 62.1,15.16 61.47,14.53 61.47,7.16 60.71,6.4 60,6.4 v1(59.87,6.53)
R_B_EN_IN: length 4.8
  Bottom Layer w0.254: U33.9 60.89,18.49 R58.1
  Bottom Layer w0.508: R75.2 63.27,18.1 R58.1
R_B_PH: length 15.4
  Top Layer w0.254: v1(60.58,7.16) 60.37,7.37 U32.15
  Bottom Layer w0.254: v1(60.58,7.16) 61.06,7.65 61.06,14.81 59.59,16.28 U33.11
